# Altium project Board.PrjPcb
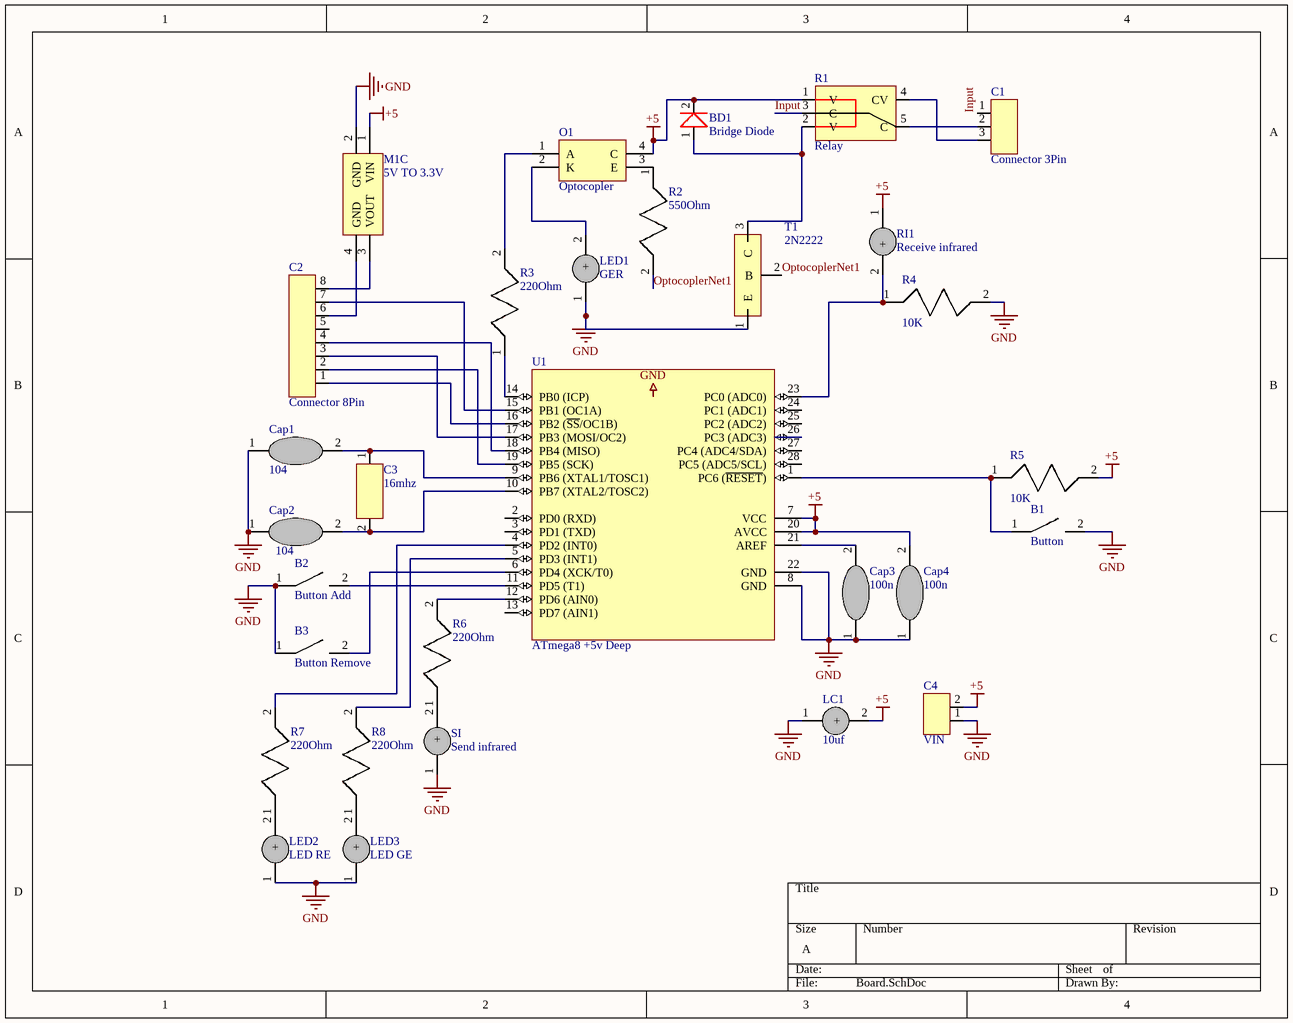
[diagram p0: Board.SchDoc]
1 sheet, 30 parts. Net scope: global (net labels, ports and power ports of the same name join across sheets).
Board file: Board.PcbDoc

## Sheet Board.SchDoc
size A; SheetNumber: 1; SheetTotal: 1

### Parts
B1  Button  [Button]
B2  Button Add  [Button]
B3  Button Remove  [Button]
BD1  Bridge Diode  [Bridge Diode]
C1  Connector 3Pin  [Connector 3Pin]
C2  Connector 8Pin  [Connector 8Pin]
C3  16mhz  [Crystal 16mhz]
C4  VIN  [Connector 2Pin]
Cap1  104  [Capacitor]
Cap2  104  [Capacitor]
Cap3  100n  [Capacitor]
Cap4  100n  [Capacitor]
LC1  10uf  [Electrolytic Capacitor]
LED1  GER  [LED]
LED2  LED RE  [LED]
LED3  LED GE  [LED]
M1  5V TO 3.3V  [5V TO 3V]  (part C of 3)
O1  Optocopler  [Optocopler]
R1  Relay  [Relay]
R2  550Ohm  [Resistor]
R3  220Ohm  [Resistor]
R4  10K  [Resistor]
R5  10K  [Resistor]
R6  220Ohm  [Resistor]
R7  220Ohm  [Resistor]
R8  220Ohm  [Resistor]
RI1  Receive infrared  [LED]
SI  Send infrared  [LED]
T1  2N2222  [Transistor]
U1  ATmega8 +5v Deep  [28P3]

### Nets
+5: BD1.2 C4.2 Cap4.2 LC1.2(+) M1.1(VIN) O1.4(C) R1.1(V) R5.2 RI1.1 U1.7(VCC) U1.20(AVCC)
GND: B1.2 B2.1 B3.1 C4.1 Cap1.1 Cap2.1 Cap3.1 Cap4.1 LC1.1 LED1.1 LED2.1 LED3.1 M1.2(GND) R4.2 SI.1 T1.1(E) U1.8(GND) U1.22(GND)
Input: C1.1 R1.3(C)
OptocoplerNet1: R2.2 T1.2(B)
NetB1_1: B1.1 R5.1 U1.1(PC6_(~{RESET}))
NetB2_2: B2.2 U1.11(PD5_(T1))
NetB3_2: B3.2 U1.6(PD4_(XCK/T0))
NetBD1_1: BD1.1 R1.2(V) T1.3(C)
NetC1_2: C1.2 R1.5(C)
NetC1_3: C1.3 R1.4(CV)
NetC2_1: C2.1 U1.16(PB2_(~{SS}/OC1B))
NetC2_2: C2.2 U1.19(PB5_(SCK))
NetC2_3: C2.3 U1.17(PB3_(MOSI/OC2))
NetC2_4: C2.4 U1.18(PB4_(MISO))
NetC2_6: C2.6 M1.4(GND)
NetC2_7: C2.7 U1.15(PB1_(OC1A))
NetC2_8: C2.8 M1.3(VOUT)
NetC3_1: C3.1 Cap1.2 U1.9(PB6_(XTAL1/TOSC1))
NetC3_2: C3.2 Cap2.2 U1.10(PB7_(XTAL2/TOSC2))
NetCap3_2: Cap3.2 U1.21(AREF)
NetLED1_2: LED1.2(+) O1.2(K)
NetLED2_2: LED2.2(+) R7.1
NetLED3_2: LED3.2(+) R8.1
NetO1_1: O1.1(A) R3.2
NetO1_3: O1.3(E) R2.1
NetR3_1: R3.1 U1.14(PB0_(ICP))
NetR4_1: R4.1 RI1.2(+) U1.23(PC0_(ADC0))
NetR6_1: R6.1 SI.2(+)
NetR6_2: R6.2 U1.12(PD6_(AIN0))
NetR7_2: R7.2 U1.4(PD2_(INT0))
NetR8_2: R8.2 U1.5(PD3_(INT1))

Not connected (* = marked no-connect by the designer): C2 5; U1 2(PD0_(RXD)) 3(PD1_(TXD)) 13(PD7_(AIN1)) 24(PC1_(ADC1)) 25(PC2_(ADC2)) 26(PC3_(ADC3)) 27(PC4_(ADC4/SDA)) 28(PC5_(ADC5/SCL))

### Notes on the sheet
- Labels drawn without touching a wire or pin: GND

### Library data of the parts
B2 B3 = Button
C3 = Crystal 16mhz
C4 = Connector 2Pin
Cap1-Cap4 = Capacitor
LC1 = Electrolytic Capacitor
LED1-LED3 RI1 SI = LED
R2-R8 = Resistor
T1 = Transistor
U1 = ATmega8L-8PI: 8-Bit AVR Microcontroller with 8K Bytes of In-System Programmable Flash Memory; Published: 17-Sep-2003; DatasheetVersion: 2486H-AVR-09/02; PackageVersion: revB, Sep-2001; PackageReference: 28P3; Publisher: Altium Limited; PackageDescription: 28-lead (0.300"/7.62mm Wide) Plastic Dual Inline Package (PDIP); Supplier 1: Digi-Key; Supplier Part Number 1: ATMEGA8L-8PI-ND; Supplier 2: Farnell; Supplier Part Number 2: 3917940; Supplier 3: Mouser; Supplier Part Number 3: 556-ATMEGA8L-8PI; ComponentLink1Description: Datasheet; ComponentLink1URL: http://www.atmel.com/dyn/resources/prod_documents/doc2486.pdf; ComponentLink2Description: Atmel.com Home; ComponentLink2URL: http://www.atmel.com